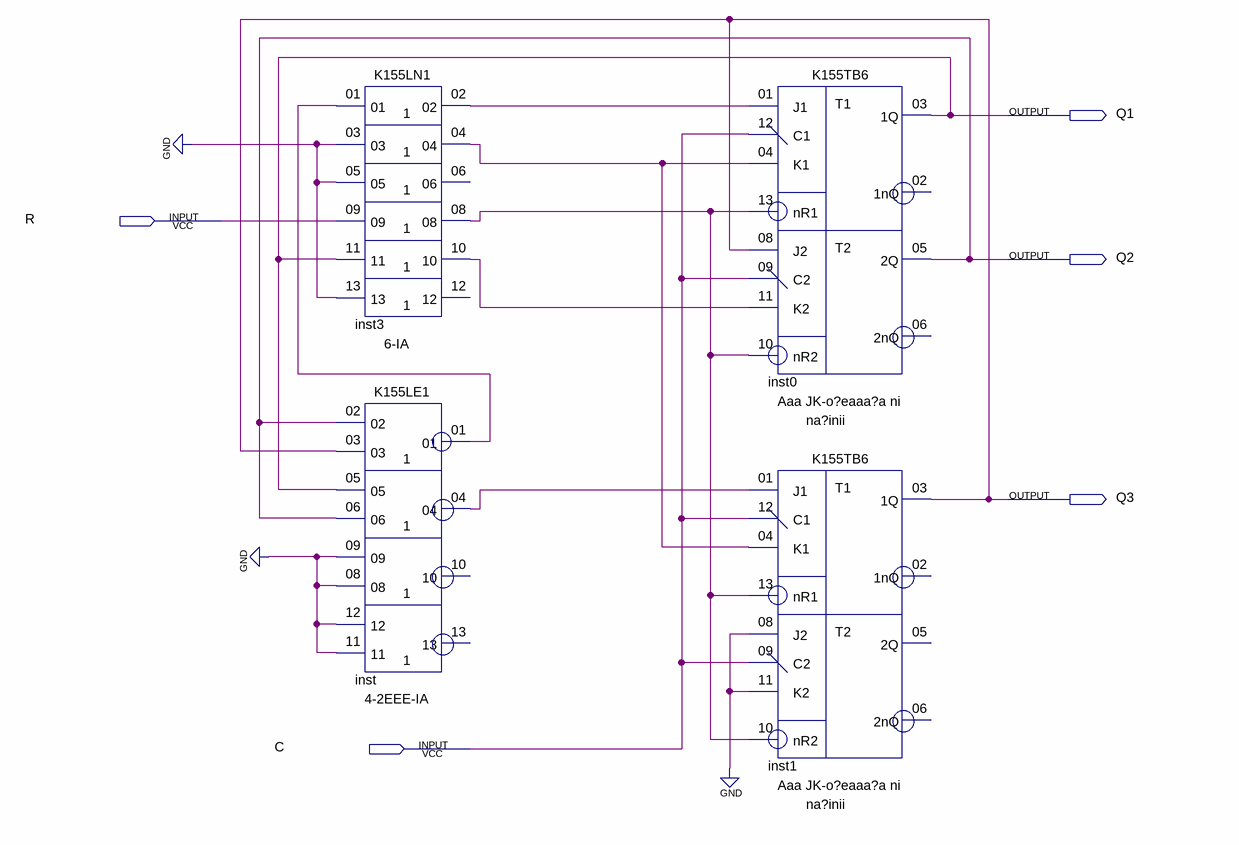
[diagram p0: schematic sheet]
// Quartus schematic subtract_counter_m5.bdf as structural Verilog: 4 symbols, 5 pins
module subtract_counter_m5 (
  input  R,
  input  C,
  output Q1,
  output Q2,
  output Q3
);

  wire inst3_02, inst3_04, inst3_08, inst3_10, inst_01, inst_04;

  K155LN1 inst3 (
    .\01 (inst_01), .\03 (1'b0), .\05 (1'b0), .\09 (R), .\11 (Q1), .\13 (1'b0), .\02 (inst3_02),
    .\04 (inst3_04), .\08 (inst3_08), .\10 (inst3_10));  // open: 06, 12
  K155LE1 inst (
    .\02 (Q2), .\03 (Q3), .\05 (Q1), .\06 (Q2), .\09 (1'b0), .\08 (1'b0), .\12 (1'b0), .\11 (1'b0),
    .\01 (inst_01), .\04 (inst_04));  // open: 10, 13
  K155TB6 inst0 (
    .J1(inst3_02), .nR1(inst3_08), .C1(C), .K1(inst3_04), .J2(Q3), .nR2(inst3_08), .C2(C), .K2(inst3_10),
    .\1Q (Q1), .\2Q (Q2));  // open: 1nQ, 2nQ
  K155TB6 inst1 (
    .J1(inst_04), .nR1(inst3_08), .C1(C), .K1(inst3_04), .J2(1'b0), .nR2(inst3_08), .C2(C), .K2(1'b0),
    .\1Q (Q3));  // open: 1nQ, 2Q, 2nQ
endmodule
